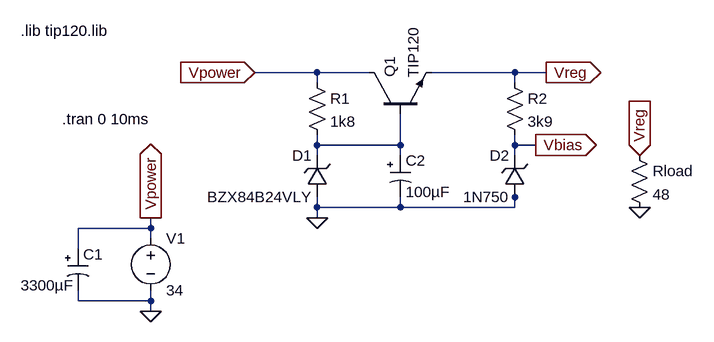
[diagram p0: schematic Power-circuit2.asc]
Power-circuit2.asc, the LTspice schematic file:
Version 4
SHEET 1 880 680
WIRE 160 160 64 160
WIRE 240 160 160 160
WIRE 464 160 336 160
WIRE 512 160 464 160
WIRE 160 176 160 160
WIRE 464 176 464 160
WIRE 160 272 160 256
WIRE 288 272 288 224
WIRE 288 272 160 272
WIRE 464 272 464 256
WIRE 496 272 464 272
WIRE 160 288 160 272
WIRE 288 288 288 272
WIRE 464 288 464 272
WIRE 464 352 464 336
WIRE 160 368 160 352
WIRE 288 368 288 352
WIRE 288 368 160 368
WIRE 464 368 464 352
WIRE 464 368 288 368
WIRE 160 384 160 368
WIRE -96 400 -96 384
WIRE -96 400 -208 400
WIRE -96 416 -96 400
WIRE -208 432 -208 400
WIRE -208 512 -208 496
WIRE -96 512 -96 496
WIRE -96 512 -208 512
WIRE -96 528 -96 512
FLAG -96 528 0
FLAG -96 384 Vpower
IOPIN -96 384 Out
FLAG 512 160 Vreg
IOPIN 512 160 Out
FLAG 64 160 Vpower
IOPIN 64 160 In
FLAG 160 384 0
FLAG 496 272 Vbias
IOPIN 496 272 Out
FLAG 656 368 0
FLAG 656 288 Vreg
IOPIN 656 288 In
SYMBOL Voltage -96 400 R0
SYMATTR InstName V1
SYMATTR Value 34
SYMBOL polcap -224 432 R0
WINDOW 3 -72 56 Left 2
SYMATTR Value 3300µF
SYMATTR InstName C1
SYMBOL zener 176 352 R180
WINDOW 0 24 64 Left 2
WINDOW 3 24 0 Left 2
SYMATTR InstName D1
SYMATTR Value BZX84B24VLY
SYMBOL Res 144 160 R0
SYMATTR InstName R1
SYMATTR Value 1k8
SYMBOL npn 240 224 R270
SYMATTR InstName Q1
SYMATTR Value TIP120
SYMATTR Prefix X
SYMBOL polcap 272 288 R0
SYMATTR InstName C2
SYMATTR Value 100µF
SYMBOL Res 448 160 R0
SYMATTR InstName R2
SYMATTR Value 3k9
SYMBOL zener 480 352 R180
WINDOW 0 24 64 Left 2
WINDOW 3 24 0 Left 2
SYMATTR InstName D2
SYMATTR Value 1N750
SYMBOL Res 640 272 R0
SYMATTR InstName Rload
SYMATTR Value 48
TEXT -232 232 Left 2 !.tran 0 10ms
TEXT -296 96 Left 2 !.lib tip120.lib

The netlist it stands for:
* Power-circuit2.asc
V1 Vpower 0 34
C1 Vpower 0 3300µF
D1 0 N001 BZX84B24VLY
R1 Vpower N001 1k8
XQ1 Vpower N001 Vreg TIP120  ; pins C B E
C2 N001 0 100µF
R2 Vreg Vbias 3k9
D2 0 Vbias 1N750
Rload Vreg 0 48
.model D D
.lib standard.dio
.tran 0 10ms
.lib tip120.lib
.backanno
.end